# EAGLE design evalavr (EAGLE 5.09)
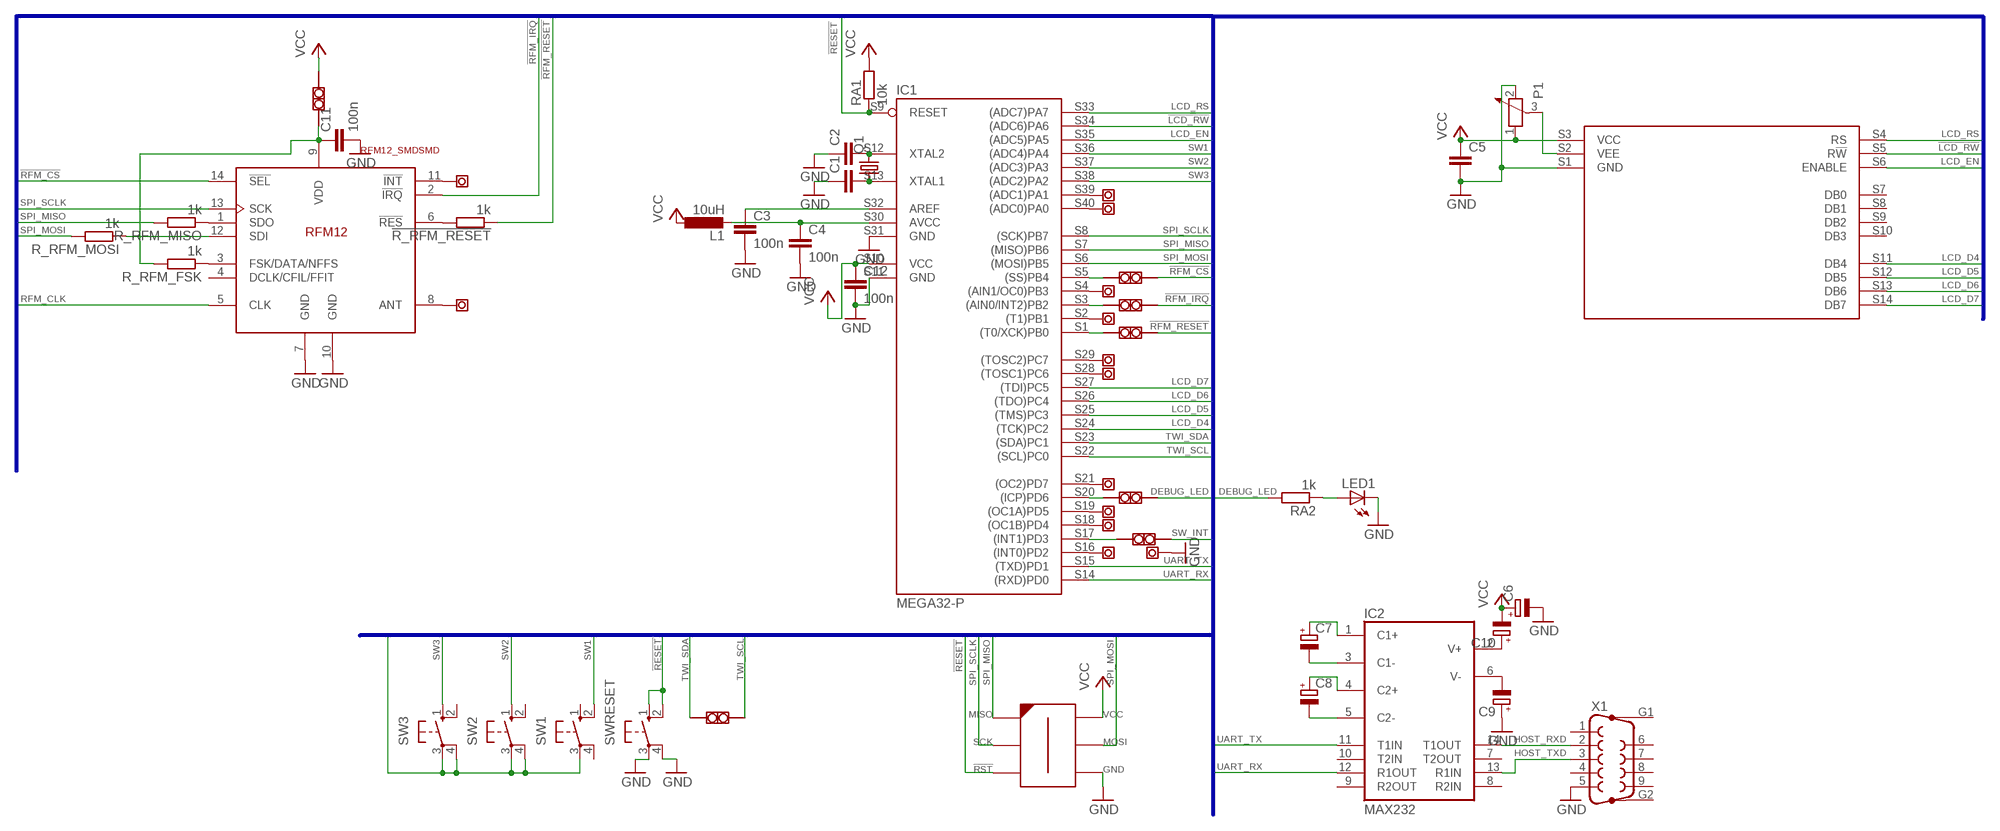
[diagram p0: schematic, sheet 1]

## Parts
!R_RFM_RESET  1k  R-EU_MELF0204W  [MINI_MELF-0204W]
!RFM_RESET  PIN2  [PIN2-DIL]
C1  C-EUC025-030X050  [C025-030X050]
C2  C-EUC025-030X050  [C025-030X050]
C3  100n  C-EUC1206  [C1206]
C4  100n  C-EUC1206  [C1206]
C5  C-EUC1206  [C1206]
C6  CPOL-EUB45181A  [B45181A]
C7  CPOL-EUB45181A  [B45181A]
C8  CPOL-EUB45181A  [B45181A]
C9  CPOL-EUB45181A  [B45181A]
C10  CPOL-EUB45181A  [B45181A]
C11  100n  C-EUC1206  [C1206]
C12  100n  C-EUC1206  [C1206]
DEBUG  PIN2  [PIN2-DIL]
IC1  MEGA32-P  [DIL_SMD_40]
IC2  MAX232  [DIL16]
L1  10uH  L-EU0204/7  [0204/7]
LED1  LED5MM  [LED5MM]
P1  POTENTIOMETER_PT_SPIN  [PT-SPIN]
Q1  CRYSTALHC49S  [HC49/S]
R_RFM_FSK  1k  R-EU_MELF0204W  [MINI_MELF-0204W]
R_RFM_MISO  1k  R-EU_MELF0204W  [MINI_MELF-0204W]
R_RFM_MOSI  1k  R-EU_MELF0204W  [MINI_MELF-0204W]
RA1  10k  R-EU_MELF0204W  [MINI_MELF-0204W]
RA2  1k  R-EU_MELF0204W  [MINI_MELF-0204W]
RFM_CS  PIN2  [PIN2-DIL]
RFM_IRQ  PIN2  [PIN2-DIL]
RFM_VCC  PIN2  [PIN2-DIL]
SW1  10-XX  [B3F-10XX]
SW2  10-XX  [B3F-10XX]
SW3  10-XX  [B3F-10XX]
SW_INT  PIN2  [PIN2-DIL]
SWRESET  10-XX  [B3F-10XX]
TWI  PIN2  [PIN2-DIL]
U$1  AVR-ISP-6-EDGEDIP_PADS  [6ROW_MY_ISP]
U$2  SIEMENS-TLCD-NBLSMD  [SIEMENS_DISPLAY_SMD]
U$3  ANT  [PIN1-ANT]
U$4  PIN1  [PIN1-DIL]
U$5  PIN1  [PIN1-DIL]
U$6  PIN1  [PIN1-DIL]
U$7  PIN1  [PIN1-DIL]
U$8  PIN1  [PIN1-DIL]
U$9  PIN1  [PIN1-DIL]
U$10  PIN1  [PIN1-DIL]
U$11  PIN1  [PIN1-DIL]
U$12  PIN1  [PIN1-DIL]
U$13  PIN1  [PIN1-DIL]
U$14  PIN1  [PIN1-DIL]
U$21  PIN1  [PIN1-DIL]
U$24  RFM12_SMDSMD  [RFM12]
X1  SUBD9_BUCHSE  [F09HP]

## Nets
!LCD_RW: IC1.S34((ADC6)PA6) U$2.S5(R!W)
!RESET: IC1.S9(RESET) RA1.1 SWRESET.1(S) SWRESET.2(S1) U$1.P$3(!RST)
!RFM_CS: RFM_CS.1 U$24.14(!SEL)
!RFM_IRQ: RFM_IRQ.1 U$24.2(!IRQ)
!RFM_RESET: !R_RFM_RESET.1 !RFM_RESET.1
DEBUG_LED: DEBUG.1 RA2.2
GND: C1.1 C2.1 C3.2 C4.2 C5.2 C6.- C9.+ C11.2 C12.2 IC1.S11(GND) IC1.S31(GND) LED1.K(C) P1.2 SWRESET.3(P) SWRESET.4(P1) U$1.P$1(GND) U$2.S1(GND) U$13.1 U$24.7(GND) U$24.10(GND) X1.5
HOST_RXD: IC2.14(T1OUT) X1.2
HOST_TXD: IC2.13(R1IN) X1.3
LCD_D4: IC1.S24((TCK)PC2) U$2.S11(DB4)
LCD_D5: IC1.S25((TMS)PC3) U$2.S12(DB5)
LCD_D6: IC1.S26((TDO)PC4) U$2.S13(DB6)
LCD_D7: IC1.S27((TDI)PC5) U$2.S14(DB7)
LCD_EN: IC1.S35((ADC5)PA5) U$2.S6(ENABLE)
LCD_RS: IC1.S33((ADC7)PA7) U$2.S4(RS)
N$1: C9.- IC2.6(V-)
N$2: C2.2 IC1.S12(XTAL2) Q1.2
N$3: C1.2 IC1.S13(XTAL1) Q1.1
N$4: C3.1 IC1.S32(AREF)
N$5: C4.1 IC1.S30(AVCC) L1.2
N$6: IC1.S5((SS)PB4) RFM_CS.2
N$7: P1.3 U$2.S2(VEE)
N$8: C10.+ IC2.2(V+)
N$9: IC1.S3((AIN0/INT2)PB2) RFM_IRQ.2
N$10: U$3.1 U$24.8(ANT)
N$11: C8.- IC2.5(C2-)
N$12: C8.+ IC2.4(C2+)
N$13: C7.- IC2.3(C1-)
N$14: C7.+ IC2.1(C1+)
N$15: R_RFM_MISO.1 U$24.1(SDO)
N$16: R_RFM_MOSI.1 U$24.12(SDI)
N$17: DEBUG.2 IC1.S20((ICP)PD6)
N$18: !R_RFM_RESET.2 U$24.6(!RES)
N$20: IC1.S4((AIN1/OC0)PB3) U$6.1
N$21: R_RFM_FSK.1 U$24.3(FSK/DATA/NFFS)
N$22: !RFM_RESET.2 IC1.S1((T0/XCK)PB0)
N$23: IC1.S2((T1)PB1) U$7.1
N$24: IC1.S39((ADC1)PA1) U$4.1
N$25: IC1.S40((ADC0)PA0) U$5.1
N$26: IC1.S28((TOSC1)PC6) U$8.1
N$27: IC1.S29((TOSC2)PC7) U$9.1
N$28: IC1.S21((OC2)PD7) U$10.1
N$29: IC1.S19((OC1A)PD5) U$11.1
N$30: LED1.A RA2.1
N$31: U$21.1 U$24.11(!INT)
N$32: IC1.S18((OC1B)PD4) U$12.1
N$33: IC1.S17((INT1)PD3) SW_INT.2
N$34: IC1.S16((INT0)PD2) U$14.1
RFM_CLK: U$24.5(CLK)
SPI_MISO: IC1.S7((MISO)PB6) R_RFM_MISO.2 U$1.P$5(MISO)
SPI_MOSI: IC1.S6((MOSI)PB5) R_RFM_MOSI.2 U$1.P$6(MOSI)
SPI_SCLK: IC1.S8((SCK)PB7) U$1.P$4(SCK) U$24.13(SCK)
SW1: IC1.S36((ADC4)PA4) SW1.2(S1)
SW2: IC1.S37((ADC3)PA3) SW2.1(S)
SW3: IC1.S38((ADC2)PA2) SW3.1(S)
SW_INT: SW1.3(P) SW2.3(P) SW2.4(P1) SW3.3(P) SW3.4(P1) SW_INT.1
TWI_SCL: IC1.S22((SCL)PC0) TWI.2
TWI_SDA: IC1.S23((SDA)PC1) TWI.1
UART_RX: IC1.S14((RXD)PD0) IC2.12(R1OUT)
UART_TX: IC1.S15((TXD)PD1) IC2.11(T1IN)
VCC: C5.1 C6.+ C10.- C12.1 IC1.S10(VCC) L1.1 P1.1 RA1.2 RFM_VCC.2 U$1.P$2(VCC) U$2.S3(VCC)
VDD: C11.1 R_RFM_FSK.2 RFM_VCC.1 U$24.9(VDD)
Unconnected: IC2.7(T2OUT) IC2.8(R2IN) IC2.9(R2OUT) IC2.10(T2IN) SW1.1(S) SW1.4(P1) SW2.2(S1) SW3.2(S1) U$2.S7(DB0) U$2.S8(DB1) U$2.S9(DB2) U$2.S10(DB3) U$24.4(DCLK/CFIL/FFIT) X1.1 X1.4 X1.6 X1.7 X1.8 X1.9 X1.G1 X1.G2

## Buses
BUS:SPI_MISO,SPI_MOSI,SPI_SCLK,!RESET,!LCD_RW,LCD_EN,LCD_RS,LCD_D4,LCD_D5,LCD_D6,LCD_D7,UART_TX,UART_RX,ADC0,ADC1,DEBUG_LED,!RFM_IRQ,!RFM_CS,RFM_CLK,!RFM_RESET,TWI_SDA,TWI_SCL,SW1,SW2,SW3,SW_INT

## Power pins joined to a net without a drawn wire
GND: IC2.15(GND)
VCC: IC2.16(VCC)

## Library data of the parts
!R_RFM_RESET R_RFM_FSK R_RFM_MISO R_RFM_MOSI RA1 RA2 = rcl:R-EU_: RESISTOR, European symbol
!RFM_RESET DEBUG RFM_CS RFM_IRQ RFM_VCC SW_INT TWI = evallib:PIN2
C1 C2 = evallib:C-EU: CAPACITOR, European symbol
C3-C5 C11 C12 = rcl:C-EU: CAPACITOR, European symbol
C6-C10 = evallib:CPOL-EU: POLARIZED CAPACITOR, European symbol
IC1 = evallib:MEGA32-P: MICROCONTROLLER 32 Kbytes FLASH 2 Kbytes SRAM 1 Kbytes EEPROM USART 8-channel 10 bit ADC Source: www.atmel.com .. doc2503.pdf
IC2 = evallib:MAX232: RS232 TRANSEIVER
L1 = evallib:L-EU: INDUCTOR, European symbol
LED1 = evallib:LED: LED OSRAM: - CHIPLED LG R971, LG N971, LY N971, LG Q971, LY Q971, LO R971, LY R971 LH N974, LH R974 LS Q976, LO Q976, LY Q976 LO Q996 - Hyper CHIPLED LW Q18S LB Q993, LB Q99A, LB R99A - SideLED LS A670, LO A670, LY A670, LG A670, LP A670 LB A673, LV A673, LT A673, LW A673 LH A674 LY A675 LS A676, LA A676, LO A676, LY A676, LW A676 LS A679, LY A679, LG A679 - Hyper Micro SIDELED® LS Y876, LA Y876, LO Y876, LY Y876 LT Y87S - SmartLED LW L88C, LW L88S LB L89C, LB L89S, LG L890 LS L89K, LO L89K, LY L89K LS L896, LA L896, LO L896, LY L896 - TOPLED LS T670, LO T670, LY T670, LG T670, LP T670 LSG T670, LSP T670, LSY T670, LOP T670, LYG T670 LG T671, LOG T671, LSG T671 LB T673, LV T673, LT T673, LW T673 LH T674 LS T676, LA T676, LO T676, LY T676, LB T676, LH T676, LSB T676, LW T676 LB T67C, LV T67C, LT T67C, LS T67K, LO T67K, LY T67K, LW E67C LS E67B, LA E67B, LO E67B, LY E67B, LB E67C, LV E67C, LT E67C LW T67C LS T679, LY T679, LG T679 LS T770, LO T770, LY T770, LG T770, LP T770 LB T773, LV T773, LT T773, LW T773 LH T774 LS E675, LA E675, LY E675, LS T675 LS T776, LA T776, LO T776, LY T776, LB T776 LHGB T686 LT T68C, LB T68C - Hyper Mini TOPLED® LB M676 - Mini TOPLED Santana® LG M470 LS M47K, LO M47K, LY M47K Source: http://www.osram.convergy.de LUXEON: - LUMILED® LXK2-PW12-R00, LXK2-PW12-S00, LXK2-PW14-U00, LXK2-PW14-V00 LXK2-PM12-R00, LXK2-PM12-S00, LXK2-PM14-U00 LXK2-PE12-Q00, LXK2-PE12-R00, LXK2-PE12-S00, LXK2-PE14-T00, LXK2-PE14-U00 LXK2-PB12-K00, LXK2-PB12-L00, LXK2-PB12-M00, LXK2-PB14-N00, LXK2-PB14-P00, LXK2-PB14-Q00 LXK2-PR12-L00, LXK2-PR12-M00, LXK2-PR14-Q00, LXK2-PR14-R00 LXK2-PD12-Q00, LXK2-PD12-R00, LXK2-PD12-S00 LXK2-PH12-R00, LXK2-PH12-S00 LXK2-PL12-P00, LXK2-PL12-Q00, LXK2-PL12-R00 Source: www.luxeon.com KINGBRIGHT: KA-3528ASYC Source: www.kingbright.com
P1 = evallib:POTENTIOMETER_: Potentiometer
Q1 = crystal:CRYSTAL: CRYSTAL
SW1-SW3 SWRESET = switch-omron:10-XX: OMRON SWITCH
U$1 = evallib:AVR-ISP-6-EDGE: 6 pin edge connector for ISP with ATMEL MCUs. Developed by Craig Moates (craig at moates dot net). Library by David Blundell (blundar at gmail dot com). Often, even a 6 pin header is really inconvenient for board layout and/or production. This SMD-only header is our de-facto standard for using an edge connector for programming with the help of a 6pin/10pin to edge card adapter.
U$2 = evallib:SIEMENS-TLCD-NBL
U$3 = evallib:ANT
U$4-U$14 U$21 = evallib:PIN1
U$24 = evallib:RFM12_SMD: RFM12 is a low costing ISM band transceiver module implemented with unique PLL. It works signal ranges from 315/433/868/915MHZ bands, comply with FCC, ETSI regulation. The SPI interface is used to communicate with microcontroller for parameter setting.
X1 = evallib:SUBD9_BUCHSE: SUB-D

## Board
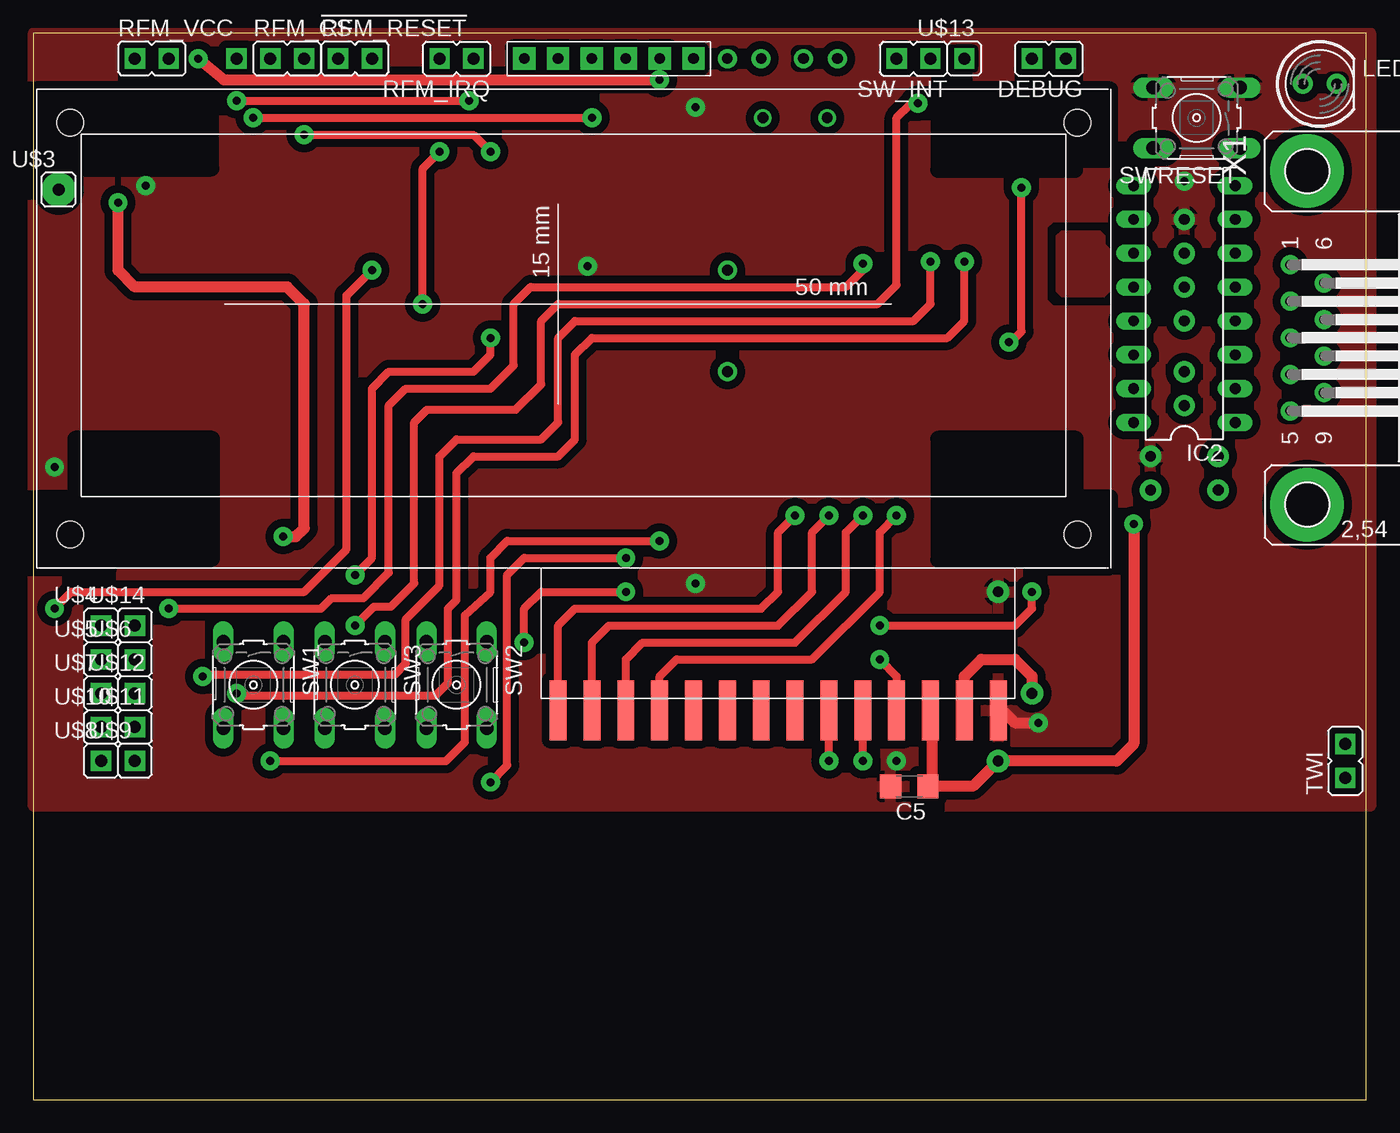
[diagram p1: board, top side]
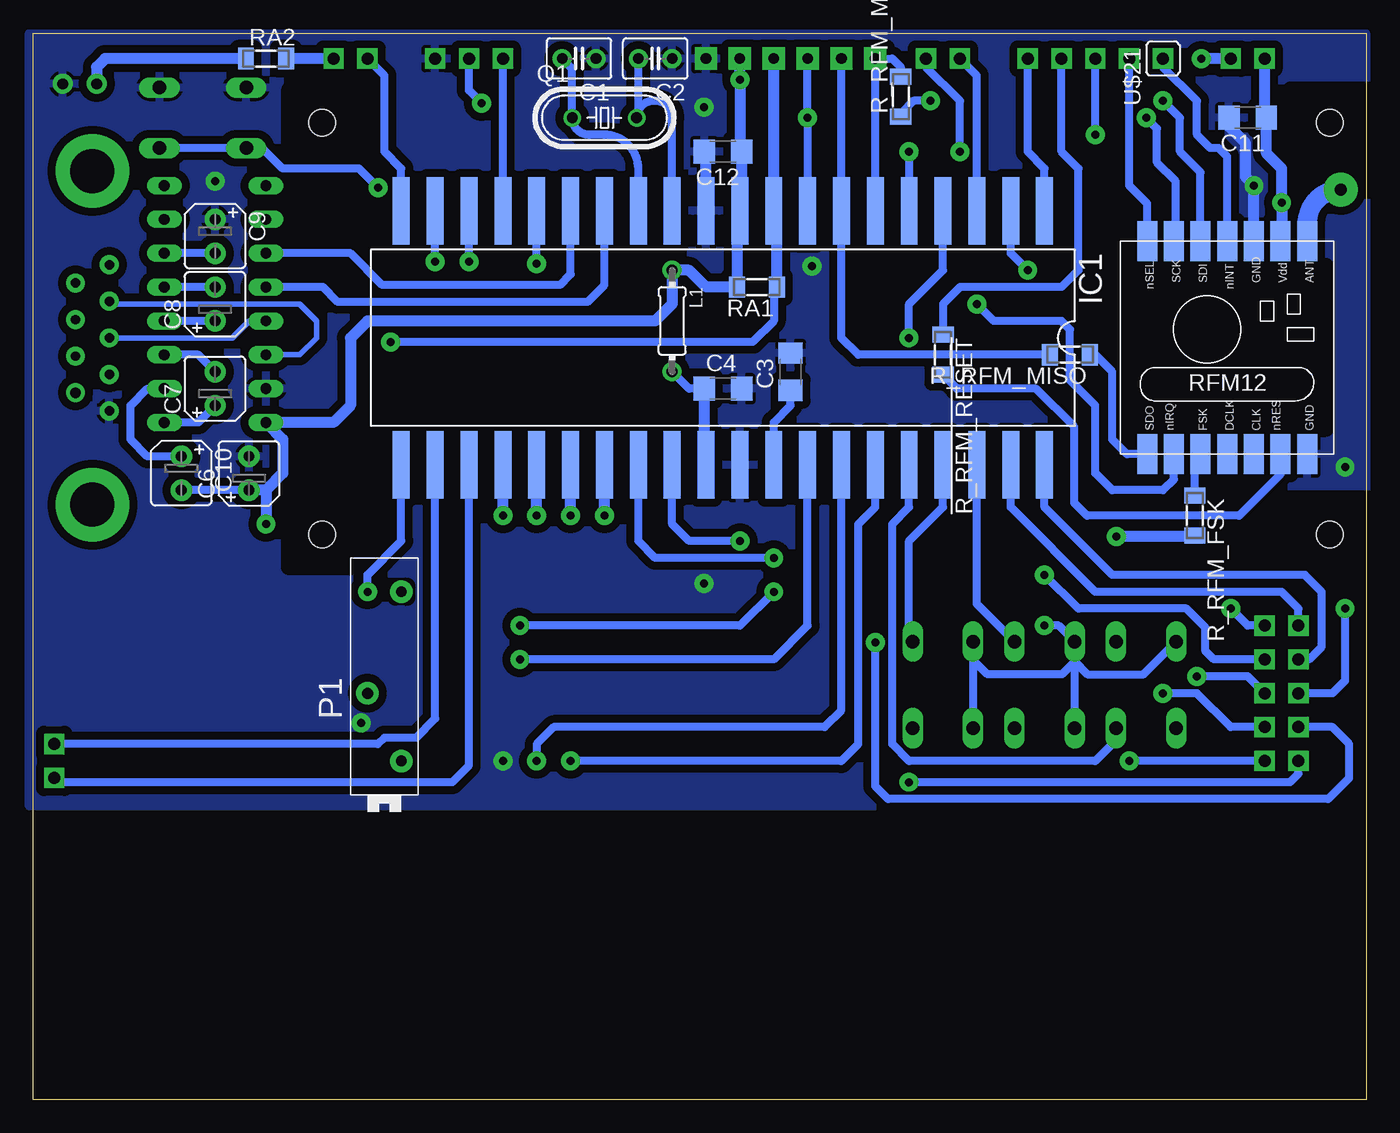
[diagram p2: board, bottom side, seen from below]

Size 100 x 80 mm. Coordinates in mm from the lower left corner, seen from the top.
Outline: 0,0 100,0 100,80 0,80 0,0
Copper layers (1*16): Top 0.035mm / dielectric 1.5mm / Bottom 0.035mm
Design rules "default *": minimum track width 10mil, minimum drill 1mil, track to track 10mil, track to pad 10mil, pad to pad 10mil, via to via 10mil, smd to smd 10mil, copper to edge 0mil, drill to drill 8mil, minimum pad ring 10mil, minimum via ring 8mil, stop-mask expansion 4mil, vias tented up to drill 0mil, thermal gap 10mil
tRestrict: area 93.9,51.3 to 94.7,52.1; area 97.4,75.9 to 98.1,76.5; area 57.4,77.7 to 58.2,78.5; area 51.7,77.7 to 52.4,78.5; area 48.9,77.4 to 50.1,78.7; area 69.4,77.6 to 70.3,78.6; area 81.6,52.9 to 83.5,53.8
bRestrict: area 72,37.7 to 72.9,38.6

### Footprints (pad centres in the part's own frame; a part is rotated, then mirrored left to right if it is on the bottom)
MINI_MELF-0204W = smd 1.2 x 1.6: 1 -1.5,0; 2 1.5,0
PIN2-DIL = drill 0.9 pad 1.524 square: 1 0,-1.27; 2 0,1.27
C025-030X050 = drill 0.8 pad 1.422 round: 1 -1.27,0; 2 1.27,0
C1206 = smd 1.6 x 1.8: 1 -1.4,0; 2 1.4,0
B45181A = drill 0.813 pad 1.6 round: + -1.27,0; - 1.27,0
DIL_SMD_40 = smd 1.27 x 5.08: S1 -24.13,-9.525; S2 -21.59,-9.525; S3 -19.05,-9.525; S4 -16.51,-9.525; S5 -13.97,-9.525; S6 -11.43,-9.525; S7 -8.89,-9.525; S8 -6.35,-9.525; S9 -3.81,-9.525; S10 -1.27,-9.525; S11 1.27,-9.525; S12 3.81,-9.525; S13 6.35,-9.525; S14 8.89,-9.525; S15 11.43,-9.525; S16 13.97,-9.525; S17 16.51,-9.525; S18 19.05,-9.525; S19 21.59,-9.525; S20 24.13,-9.525; S21 24.13,9.525; S22 21.59,9.525; S23 19.05,9.525; S24 16.51,9.525; S25 13.97,9.525; S26 11.43,9.525; S27 8.89,9.525; S28 6.35,9.525; S29 3.81,9.525; S30 1.27,9.525; S31 -1.27,9.525; S32 -3.81,9.525; S33 -6.35,9.525; S34 -8.89,9.525; S35 -11.43,9.525; S36 -13.97,9.525; S37 -16.51,9.525; S38 -19.05,9.525; S39 -21.59,9.525; S40 -24.13,9.525
DIL16 = drill 0.813 long: 1 -8.89,-3.81; 2 -6.35,-3.81; 3 -3.81,-3.81; 4 -1.27,-3.81; 5 1.27,-3.81; 6 3.81,-3.81; 7 6.35,-3.81; 8 8.89,-3.81; 9 8.89,3.81; 10 6.35,3.81; 11 3.81,3.81; 12 1.27,3.81; 13 -1.27,3.81; 14 -3.81,3.81; 15 -6.35,3.81; 16 -8.89,3.81
0204/7 = drill 0.813 pad 1.422 round: 1 -3.81,0; 2 3.81,0
LED5MM = drill 0.8 pad 1.5 round: A -1.27,0 | drill 0.813 pad 1.5 round: K 1.27,0
PT-SPIN = drill 0.813 pad 1.676 round: 1 -6.35,-1.27; 2 6.35,-1.27; 3 -1.27,1.27
HC49/S = drill 0.813 round: 1 -2.413,0; 2 2.413,0
B3F-10XX = drill 1.016 long: 1 -3.251,2.261; 2 3.251,2.261; 3 -3.251,-2.261; 4 3.251,-2.261
6ROW_MY_ISP = drill 0.8 pad 1.676 square: P$1 0,0; P$2 -2.54,0; P$3 -5.08,0; P$4 -7.62,0; P$5 -10.16,0; P$6 -12.7,0
SIEMENS_DISPLAY_SMD = smd 1.27 x 4.5: S1 33.02,-21.59; S2 30.48,-21.59; S3 27.94,-21.59; S4 25.4,-21.59; S5 22.86,-21.59; S6 20.32,-21.59; S7 17.78,-21.59; S8 15.24,-21.59; S9 12.7,-21.59; S10 10.16,-21.59; S11 7.62,-21.59; S12 5.08,-21.59; S13 2.54,-21.59; S14 0,-21.59 | hole 2: -36.62,22.5; -36.62,-8.4; 38.96,22.5; 38.96,-8.4
PIN1-ANT = drill 0.9 pad 2.54 round: 1 0,0
PIN1-DIL = drill 0.9 pad 1.524 square: 1 0,0
RFM12 = smd 1.5 x 3: 1 -5,-10; 2 -3,-10; 3 -1,-10; 4 1,-10; 5 3,-10; 6 5,-10; 7 7,-10; 8 7,6; 9 5,6; 10 3,6; 11 1,6; 12 -1,6; 13 -3,6; 14 -5,6
F09HP = drill 0.7 pad 1.422 round: 1 -5.486,-1.27; 2 -2.743,-1.27; 3 0,-1.27; 4 2.743,-1.27; 5 5.486,-1.27; 6 -4.115,1.27; 7 -1.372,1.27; 8 1.372,1.27 | drill 0.8 pad 1.422 round: 9 4.115,1.27 | drill 3.302 pad 5.5 round: G1 -12.522,0; G2 12.522,0

### Placement (x,y rotation side)
!R_RFM_RESET  31.75,55.88 270 bottom
!RFM_RESET  24.13,78.11 270 top
C1  59.05,78.11 180 bottom
C2  53.34,78.11 180 bottom
C3  43.18,54.61 90 bottom
C4  48.26,53.34 0 bottom
C5  65.72,23.5 180 top
C6  83.82,46.99 90 bottom
C7  86.36,53.34 90 bottom
C8  86.36,59.69 90 bottom
C9  86.36,64.77 270 bottom
C10  88.9,46.99 270 bottom
C11  8.89,73.66 180 bottom
C12  48.26,71.12 180 bottom
DEBUG  76.2,78.11 90 top
IC1  48.26,57.15 180 bottom
IC2  86.36,59.69 90 top
L1  52.07,58.42 270 bottom
LED1  96.52,76.2 0 top
P1  73.66,31.75 90 bottom
Q1  57.15,73.66 0 bottom
R_RFM_FSK  12.86,43.81 270 bottom
R_RFM_MISO  22.23,55.88 180 bottom
R_RFM_MOSI  34.92,75.25 90 bottom
RA1  45.72,60.96 180 bottom
RA2  82.55,78.11 0 bottom
RFM_CS  19.05,78.11 270 top
RFM_IRQ  31.75,78.11 90 top
RFM_VCC  8.89,78.11 270 top
SW1  16.51,31.11 270 top
SW2  31.75,31.11 270 top
SW3  24.13,31.11 270 top
SW_INT  66.04,78.11 90 top
SWRESET  87.28,73.66 180 top
TWI  98.42,25.4 0 top
U$1  49.53,78.11 0 top
U$2  39.37,50.8 0 top
U$3  1.91,68.26 0 top
U$4  5.08,35.56 0 top
U$5  5.08,33.02 0 top
U$6  7.62,33.02 0 top
U$7  5.08,30.48 0 top
U$8  5.08,25.4 0 top
U$9  7.62,25.4 0 top
U$10  5.08,27.94 0 top
U$11  7.62,27.94 0 top
U$12  7.62,30.48 0 top
U$13  69.85,78.11 0 top
U$14  7.62,35.56 0 top
U$21  15.24,78.11 90 bottom
U$24  11.43,58.42 0 bottom
X1  95.57,57.15 270 top

### Tracks (layer width: path | path; a pad name or v marks a point on that pad's centre or on a via)
!LCD_RW  (via drill 0.6 pad 1.42)
  Top 0.61: v62.23,25.4 U$2.S5
  Bottom 0.61: IC1.S34 39.37,29.21 40.64,27.94 60.96,27.94 62.23,26.67 v62.23,25.4
!RESET  (via drill 0.6 pad 1.42)
  Top 0.61: v74.14,68.42 74.14,57.63 73.66,57.15 73.5,56.99 73.34,56.83 v73.18,56.83
  Bottom 0.61: v74.14,68.42 75.56,69.85 81.28,69.85 82.83,71.4 SWRESET.2 SWRESET.1 | v73.18,56.83 46.04,56.83 44.45,58.42 44.45,60.73 RA1.1
  Bottom 0.813: RA1.1 44.22,66.44 IC1.S9 U$1.P$3
!RFM_CS
  Bottom 0.61: RFM_CS.1 17.78,68.58 16.43,67.23 U$24.14
!RFM_IRQ  (via drill 0.6 pad 1.42)
  Top 0.61: v29.21,59.69 29.21,69.85 v30.48,71.12
  Bottom 0.61: v30.48,71.12 30.48,74.93 33.02,77.47 RFM_IRQ.1 | v29.21,59.69 27.94,58.42 22.86,58.42 22.23,57.78 22.23,53.98 20.32,52.07 20.32,46.99 19.05,45.72 15.24,45.72 14.43,46.53 U$24.2
!RFM_RESET
  Bottom 0.61: !RFM_RESET.1 22.86,71.12 21.59,69.85 21.59,62.23 22.86,60.96 30.48,60.96 31.75,59.69 !R_RFM_RESET.1
DEBUG_LED
  Bottom 0.813: DEBUG.1 RA2.2
GND  (via drill 0.6 pad 1.42)
  Top 0.813: U$2.S1 72.71,29.21 73.66,28.26 v75.41,28.26
  Bottom 0.813: IC1.S11 49.53,70.99 C12.2 | C11.2 10.32,73.63 10.32,73.03 9.05,71.75 9.05,69.22 v8.41,68.58 8.41,64.44 U$24.10
  other vias: 64.77,25.4 49.69,74.45 41.59,62.55 1.59,47.47 86.36,68.9 49.69,38.73
  pour Bottom (isolate 0.6): 0,80.01 0,22 100.33,22 100.33,80.01
  pour Top (isolate 0.6, rank 2): 0,22 0,80.01 100.33,80.01 100.33,22
HOST_RXD
  Bottom 0.406: IC2.14 80.01,55.88 78.74,57.15 78.74,58.42 80.01,59.69 94.09,59.69 X1.2
HOST_TXD
  Bottom 0.406: IC2.13 83.82,58.42 85.09,57.15 X1.3
LCD_D4  (via drill 0.6 pad 1.42)
  Top 0.61: U$2.S11 46.99,31.75 48.26,33.02 58.42,33.02 63.5,38.1 63.5,42.55 v64.77,43.81
  Bottom 0.813: v64.77,43.81 IC1.S24
LCD_D5  (via drill 0.6 pad 1.42)
  Top 0.61: U$2.S12 44.45,33.02 45.72,34.29 57.15,34.29 60.96,38.1 60.96,42.55 v62.23,43.81
  Bottom 0.813: v62.23,43.81 IC1.S25
LCD_D6  (via drill 0.6 pad 1.42)
  Top 0.61: U$2.S13 41.91,34.29 43.18,35.56 55.88,35.56 58.42,38.1 58.42,42.55 v59.69,43.81
  Bottom 0.813: v59.69,43.81 IC1.S26
LCD_D7  (via drill 0.6 pad 1.42)
  Top 0.61: U$2.S14 39.37,35.56 40.64,36.83 54.61,36.83 55.88,38.1 55.88,42.55 v57.15,43.81
  Bottom 0.813: v57.15,43.81 IC1.S27
LCD_EN  (via drill 0.6 pad 1.42)
  Top 0.61: v59.69,25.4 U$2.S6
  Bottom 0.61: IC1.S35 36.83,44.45 38.1,43.18 38.1,26.67 39.37,25.4 v59.69,25.4
LCD_RS  (via drill 0.6 pad 1.42)
  Top 0.61: v63.5,33.02 64.77,31.75 U$2.S4
  Bottom 0.61: IC1.S33 41.91,35.56 44.45,33.02 v63.5,33.02
N$1
  Bottom 0.61: C9.- IC2.6
N$2
  Bottom 0.61: IC1.S12 52.07,73.66 arc-90 53.34,74.93 53.47,74.93 arc-90 Q1.2 54.61,73.79 C2.2
N$3
  Bottom 0.61: IC1.S13 54.61,69.85 arc-90 57.15,72.39 58.29,72.39 arc90 Q1.1 59.56,77.34 C1.2
N$4
  Bottom 0.61: C3.1 43.18,52.07 44.45,50.8 IC1.S32
N$5
  Bottom 0.61: C4.1 50.8,53.34 L1.2
  Bottom 0.813: C4.1 49.66,47.76 IC1.S30
N$6  (via drill 0.6 pad 1.42)
  Top 0.61: v20.32,72.39 33.02,72.39 v34.29,71.12
  Bottom 0.61: v34.29,71.12 IC1.S5 | v20.32,72.39 RFM_CS.2
N$7
  Top 0.813: P1.3 74.93,31.75 73.66,33.02 71.12,33.02 69.85,31.75 U$2.S2
N$8
  Bottom 0.61: IC2.2 91.44,53.34 92.71,52.07 92.71,49.53 91.44,48.26 C10.+
N$9
  Bottom 0.61: IC1.S3 29.21,76.83 RFM_IRQ.2
N$10
  Bottom 1.422: U$24.8 4.43,65.74 arc90 U$3.1
N$11
  Bottom 0.61: C8.- IC2.5
N$12
  Bottom 0.61: C8.+ IC2.4
N$13
  Bottom 0.61: IC2.3 87.63,55.88 C7.-
N$14
  Bottom 0.61: C7.+ 87.63,50.8 IC2.1
N$15
  Bottom 0.61: R_RFM_MISO.1 20.32,55.88 19.05,54.61 19.05,49.53 17.94,48.42 U$24.1
N$16  (via drill 0.6 pad 1.42)
  Top 0.61: v15.24,74.93 v32.7,74.93
  Bottom 0.61: v15.24,74.93 13.97,73.66 13.97,71.12 12.43,69.58 U$24.12 | R_RFM_MOSI.1 34.92,73.98 33.97,74.93 v32.7,74.93
N$17
  Bottom 0.61: IC1.S20 72.39,69.85 73.66,71.12 73.66,76.83 DEBUG.2
N$18
  Bottom 0.61: !R_RFM_RESET.2 30.71,53.34 24.77,53.34 21.91,50.48 21.91,44.77 20.95,43.81 9.53,43.81 6.43,46.91 U$24.6 6.35,48.34
N$19
  pour Top: 77.15,65.09 76.83,64.77 76.83,60.64 77.15,60.33 80.33,60.33 80.64,60.64 80.64,63.82 80.33,64.14 80.33,64.77 80.01,65.09
N$20  (via drill 0.6 pad 1.42)
  Top 0.61: v34.29,57.15 34.29,55.88 33.02,54.61 26.67,54.61 25.4,53.34 25.4,40.64 v24.13,39.37
  Bottom 0.61: IC1.S4 31.75,62.23 34.29,59.69 v34.29,57.15 | v24.13,39.37 21.59,36.83 13.49,36.83 12.06,35.4 12.06,33.66 11.43,33.02 U$6.1
N$21
  Bottom 0.61: 12.38,48.37 U$24.3 12.86,47.99 R_RFM_FSK.1
N$22
  Bottom 0.61: IC1.S1 24.13,69.85 25.4,71.12 !RFM_RESET.2
N$23  (via drill 0.6 pad 1.42)
  Top 0.61: v25.4,62.23 23.5,60.33 23.5,41.27 20.32,38.1 2.86,38.1 v1.59,36.83
  Bottom 0.61: IC1.S2 26.67,63.5 v25.4,62.23 | v1.59,36.83 1.59,31.43 2.54,30.48 U$7.1
N$24
  Bottom 0.61: IC1.S39 26.67,44.45 20.32,38.1 6.35,38.1 5.08,36.83 U$4.1
N$25
  Bottom 0.61: IC1.S40 24.13,44.45 19.05,39.37 4.6,39.37 3.33,38.1 3.33,33.97 4.29,33.02 U$5.1
N$26  (via drill 0.6 pad 1.42)
  Top 0.61: v44.45,40.64 36.83,40.64 35.56,39.37 35.56,25.08 v34.29,23.81
  Bottom 0.61: IC1.S28 54.61,41.91 53.34,40.64 v44.45,40.64 | v34.29,23.81 5.71,23.81 5.08,24.45 U$8.1
N$27  (via drill 0.6 pad 1.42)
  Top 0.61: v46.99,41.91 35.56,41.91 34.29,40.64 34.29,38.1 32.38,36.35 32.38,26.83 30.96,25.4 v17.78,25.4
  Bottom 0.61: IC1.S29 52.07,43.18 50.8,41.91 v46.99,41.91 | U$9.1 v17.78,25.4
N$28  (via drill 0.6 pad 1.42)
  Top 0.61: v74.93,38.1 74.93,36.83 73.66,35.56 v63.5,35.56 | v44.45,38.1 38.1,38.1 36.83,36.83 v36.83,34.29
  Bottom 0.61: IC1.S21 72.39,41.91 74.93,39.37 v74.93,38.1 | v63.5,35.56 46.99,35.56 v44.45,38.1 | U$10.1 2.54,27.94 1.27,26.67 1.27,24.13 2.86,22.54 35.88,22.54 36.83,23.5 v36.83,34.29
N$29  (via drill 0.6 pad 1.42)
  Top 0.61: v69.85,62.87 69.85,58.42 68.58,57.15 41.91,57.15 40.64,55.88 40.64,49.53 39.37,48.26 33.02,48.26 31.75,46.99 31.75,37.47 31.11,36.83 31.11,31.27 30.16,30.32 15.4,30.32 v15.24,30.48
  Bottom 0.61: v69.85,62.87 IC1.S19 | v15.24,30.48 12.7,30.48 10.16,27.94 U$11.1
N$30
  Bottom 0.813: RA2.1 94.61,78.11 95.25,77.47 LED1.A
N$31
  Bottom 0.61: U$21.1 15.24,77.47 12.7,74.93 12.7,72.39 11.7,71.39 11.06,71.39 10.43,70.75 U$24.11
N$32  (via drill 0.6 pad 1.42)
  Top 0.61: v67.31,62.87 67.31,59.69 66.04,58.42 40.64,58.42 39.37,57.15 39.37,50.8 38.1,49.53 31.75,49.53 30.48,48.26 30.48,38.58 27.94,36.04 27.94,32.7 27.15,31.91 12.86,31.91 v12.7,31.75
  Bottom 0.61: v67.31,62.87 IC1.S18 | v12.7,31.75 8.89,31.75 U$12.1
N$33
  Bottom 0.61: IC1.S17 SW_INT.2
N$34  (via drill 0.6 pad 1.42)
  Top 0.61: v10.16,36.83 21.59,36.83 22.38,37.62 24.77,37.62 26.67,39.53 26.67,52.07 27.94,53.34 34.29,53.34 36.04,55.09 36.04,59.69 37.31,60.96 60.96,60.96 62.23,62.23 v62.23,62.71
  Bottom 0.61: v62.23,62.71 IC1.S16 | v10.16,36.83 8.89,35.56 U$14.1
SPI_MISO
  Bottom 0.61: U$1.P$5 IC1.S7 39.37,57.15 38.1,55.88 R_RFM_MISO.2
SPI_MOSI
  Bottom 0.61: IC1.S6 U$1.P$6 | U$1.P$6 36.74,78.02 | R_RFM_MOSI.2 34.92,77.47 35.56,78.11 U$1.P$6
SPI_SCLK  (via drill 0.6 pad 1.42)
  Top 0.61: v16.51,73.66 v41.91,73.66
  Bottom 0.61: IC1.S8 v41.91,73.66 U$1.P$4 | v16.51,73.66 15.7,72.85 15.7,70.31 14.29,68.9 14.29,64.56 U$24.13
SW1
  Bottom 0.61: IC1.S36 34.29,44.45 35.56,43.18 35.56,26.67 34.29,25.4 20.32,25.4 19.05,26.67 19.05,27.58 SW1.2
SW2
  Bottom 0.61: IC1.S37 31.75,44.45 34.29,41.91 34.29,34.65 SW2.1
SW3
  Bottom 0.61: IC1.S38 29.21,37.19 SW3.1
SW_INT  (via drill 0.6 pad 1.42)
  Top 0.61: v66.36,74.77 65.88,74.77 64.77,73.66 64.77,61.12 63.34,59.69 39.37,59.69 38.1,58.42 38.1,53.66 36.2,51.75 29.53,51.75 28.57,50.8 28.57,38.73 26.83,36.99 25.56,36.99 v24.13,35.56
  Bottom 0.61: SW_INT.1 67.31,75.72 v66.36,74.77 | SW1.3 16.71,31.91 20.92,31.91 21.87,32.86 | SW2.4 SW2.3 29.49,32.98 28.42,31.91 22.82,31.91 21.87,32.86 | v24.13,35.56 23.06,35.56 SW3.3 21.87,33.28 21.87,32.86 | SW3.4 21.87,32.86
TWI_SCL
  Bottom 0.61: IC1.S22 69.85,28.57 71.28,27.15 73.66,27.15 74.14,26.67 TWI.2
TWI_SDA
  Bottom 0.61: IC1.S23 67.31,25.08 68.58,23.81 98.11,23.81 TWI.1
UART_RX
  Bottom 0.61: IC1.S14 57.15,61.12 58.42,59.85 77.15,59.85 78.26,60.96 IC2.12
UART_TX
  Bottom 0.61: IC2.11 76.2,63.5 73.82,61.12 60.48,61.12 59.69,61.91 IC1.S15
VCC  (via drill 0.6 pad 1.42)
  Top 0.813: v46.99,76.52 14.29,76.52 v12.38,78.11 | v82.55,43.18 82.55,26.67 81.28,25.4 P1.1 70.48,23.5 C5.1 67.44,23.81 67.44,29.08 U$2.S3
  Bottom 0.61: C6.+ C10.-
  Bottom 0.813: U$1.P$2 v46.99,76.52 46.99,71.25 C12.1 46.86,67.44 IC1.S10 47.22,66.67 RA1.2 49.53,60.96 50.8,62.23 L1.1 52.07,59.69 53.34,58.42 74.93,58.42 76.2,57.15 76.2,52.07 77.47,50.8 IC2.16 81.28,49.53 81.28,46.99 82.55,45.72 | RFM_VCC.2 v12.38,78.11 | 82.55,45.72 C6.+ | 82.55,45.72 v82.55,43.18
VDD  (via drill 0.6 pad 1.42)
  Top 0.813: v6.35,67.31 6.35,62.23 7.62,60.96 19.05,60.96 20.32,59.69 20.32,42.86 19.68,42.23 v18.73,42.23
  Bottom 0.813: U$24.9 6.35,64.5 v6.35,67.31 6.35,69.85 7.49,70.99 C11.1 7.62,73.79 RFM_VCC.1 | 12.47,42.23 12.7,42.23 | 12.7,42.23 v18.73,42.23 | R_RFM_FSK.2 12.79,42.31 12.7,42.23

### Text on the board
tRestrict: TX | RX